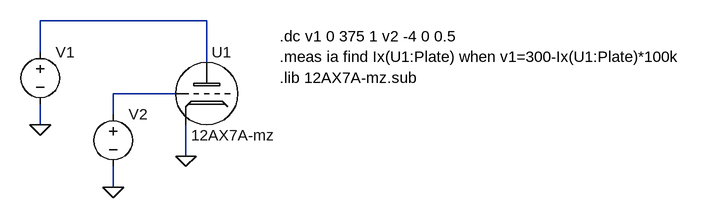
[diagram p0: schematic 12AX7-mz.asc]
12AX7-mz.asc, the LTspice schematic file:
Version 4
SHEET 1 1140 680
WIRE 368 192 112 192
WIRE 112 240 112 192
WIRE 368 256 368 192
WIRE 320 304 224 304
WIRE 224 336 224 304
WIRE 112 352 112 320
WIRE 336 400 336 352
WIRE 224 448 224 416
FLAG 336 400 0
FLAG 112 352 0
FLAG 224 448 0
SYMBOL 12AX7A-mz 368 304 R0
SYMATTR InstName U1
SYMBOL voltage 224 320 R0
SYMATTR InstName V2
SYMATTR Value ""
SYMBOL voltage 112 224 R0
SYMATTR InstName V1
SYMATTR Value ""
TEXT 480 216 Left 2 !.dc v1 0 375 1 v2 -4 0 0.5\n.meas ia find Ix(U1:Plate) when v1=300-Ix(U1:Plate)*100k
TEXT 480 280 Left 2 !.lib 12AX7A-mz.sub

The netlist it stands for:
* 12AX7-mz.asc
XU1 N001 N002 0 12AX7A-mz  ; pins Plate Grid Cathode
V2 N002 0
V1 N001 0
.dc v1 0 375 1 v2 -4 0 0.5
.meas ia find Ix(U1:Plate) when v1=300-Ix(U1:Plate)*100k
.lib 12AX7A-mz.sub
.lib 12AX7A-mz.sub
.backanno
.end